# EAGLE design ADS7128 (EAGLE 9.6.2)
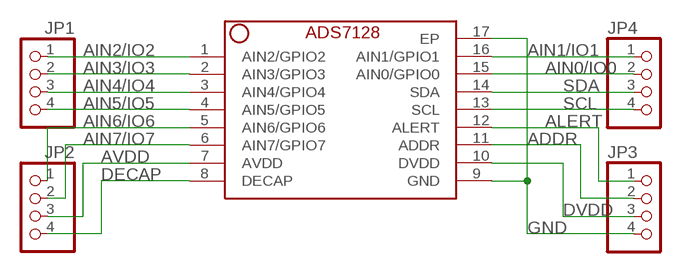
[diagram p0: schematic, sheet 1]

## Parts
JP1  PINHD-1X4  [1X04]
JP2  PINHD-1X4  [1X04]
JP3  PINHD-1X4  [1X04]
JP4  PINHD-1X4  [1X04]
U$1  ADS7128  [QFN50P300X300X80-17N]

## Nets
ADDR: JP3.2 U$1.11(ADDR)
AIN0/IO0: JP4.2 U$1.15(AIN0/GPIO0)
AIN1/IO1: JP4.1 U$1.16(AIN1/GPIO1)
AIN2/IO2: JP1.1 U$1.1(AIN2/GPIO2)
AIN3/IO3: JP1.2 U$1.2(AIN3/GPIO3)
AIN4/IO4: JP1.3 U$1.3(AIN4/GPIO4)
AIN5/IO5: JP1.4 U$1.4(AIN5/GPIO5)
AIN6/IO6: JP2.1 U$1.5(AIN6/GPIO6)
AIN7/IO7: JP2.2 U$1.6(AIN7/GPIO7)
ALERT: JP3.1 U$1.12(ALERT)
AVDD: JP2.3 U$1.7(AVDD)
DECAP: JP2.4 U$1.8(DECAP)
DVDD: JP3.3 U$1.10(DVDD)
GND: JP3.4 U$1.9(GND) U$1.17(EP)
SCL: JP4.4 U$1.13(SCL)
SDA: JP4.3 U$1.14(SDA)

## Library data of the parts
JP1-JP4 = pinhead:PINHD-1X4: PIN HEADER
U$1 = ADS7128:ADS7128

## Board
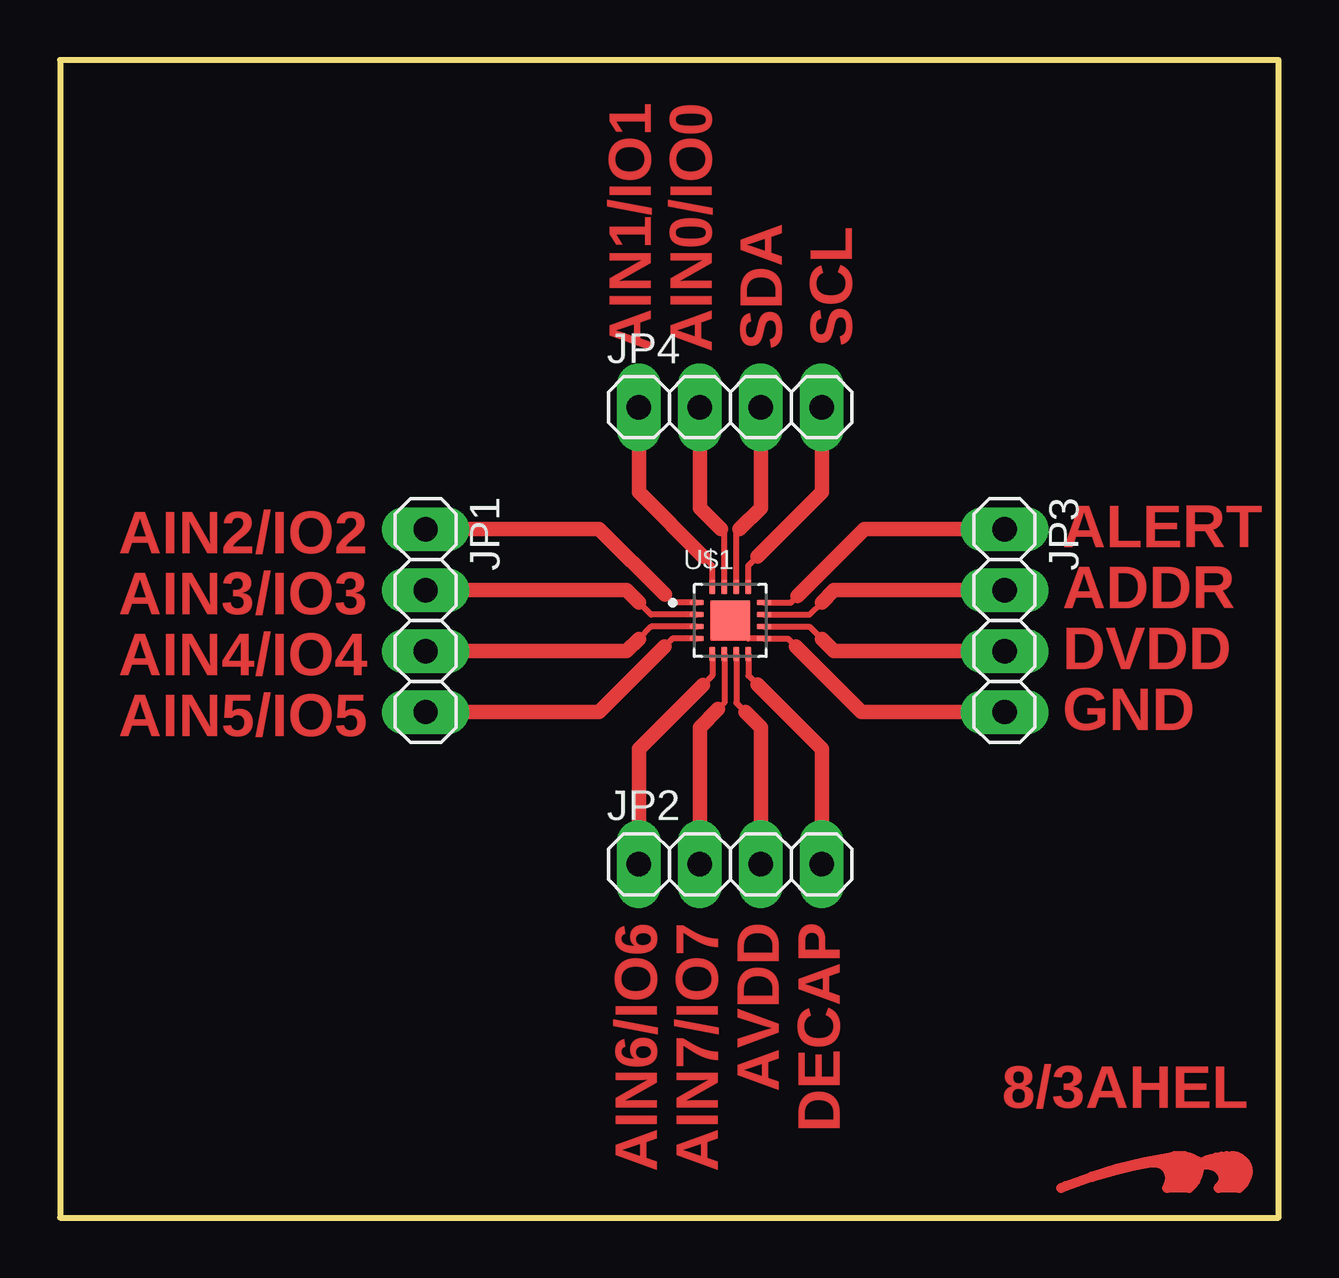
[diagram p1: board, top side]

Size 50.8 x 48.26 mm. Coordinates in mm from the lower left corner, seen from the top.
Outline: 0,0 50.8,0 50.8,48.26 0,48.26 0,0
Copper layers (1*16): Top 0.035mm / dielectric 1.5mm / Bottom 0.035mm
Design rules "default *": minimum track width 6mil, minimum drill 0.35mm, track to track 6mil, track to pad 6mil, pad to pad 6mil, via to via 6mil, smd to smd 6mil, copper to edge 40mil, drill to drill 6mil, minimum pad ring 16mil, minimum via ring 8mil, stop-mask expansion 4mil, vias tented up to drill 0mil, thermal gap 10mil

### Footprints (pad centres in the part's own frame; a part is rotated, then mirrored left to right if it is on the bottom)
1X04 = drill 1.016 long: 1 -3.81,0; 2 -1.27,0; 3 1.27,0; 4 3.81,0
QFN50P300X300X80-17N = smd 0.6 x 0.24: 1 -1.4,0.75; 2 -1.4,0.25; 3 -1.4,-0.25; 4 -1.4,-0.75; 9 1.4,-0.75; 10 1.4,-0.25; 11 1.4,0.25; 12 1.4,0.75 | smd 0.24 x 0.6: 5 -0.75,-1.4; 6 -0.25,-1.4; 7 0.25,-1.4; 8 0.75,-1.4; 13 0.75,1.4; 14 0.25,1.4; 15 -0.25,1.4; 16 -0.75,1.4 | smd 1.68 x 1.68: 17 0,0

### Placement (x,y rotation side)
JP1  15.24,24.89 270 top
JP2  27.94,14.73 0 top
JP3  39.37,24.89 270 top
JP4  27.94,33.78 0 top
U$1  27.94,24.89 0 top
U$2  [LOGOTOP_8]  46.99,1.27 0 top

### Tracks (layer width: path | path; a pad name or v marks a point on that pad's centre or on a via)
ADDR
  Top 0.254: U$1.11 31.24,25.14 31.75,25.65
  Top 0.61: JP3.2 32.26,26.16 31.75,25.65
AIN0/IO0
  Top 0.254: U$1.15 27.69,28.57 27.56,28.7
  Top 0.61: JP4.2 26.67,29.59 27.56,28.7
AIN1/IO1
  Top 0.254: U$1.16 27.19,27.18 26.8,27.57 25.67,28.7
  Top 0.61: JP4.1 24.13,30.24 26.8,27.57
AIN2/IO2
  Top 0.254: U$1.1 25.54,25.64 25.21,25.97 24.13,27.05
  Top 0.61: JP1.1 22.48,28.7 25.21,25.97
AIN3/IO3
  Top 0.254: U$1.2 24.64,25.14 24.13,25.65
  Top 0.61: JP1.2 23.62,26.16 24.13,25.65
AIN4/IO4
  Top 0.254: U$1.3 24.64,24.64 24.13,24.13
  Top 0.61: JP1.3 23.62,23.62 24.13,24.13
AIN5/IO5
  Top 0.254: U$1.4 25.52,24.14 25.2,23.82 24.13,22.75
  Top 0.61: JP1.4 22.46,21.08 25.2,23.82
AIN6/IO6
  Top 0.254: U$1.5 27.19,22.6 26.8,22.22 26.68,22.1
  Top 0.61: JP2.1 24.13,19.54 26.8,22.22
AIN7/IO7
  Top 0.254: U$1.6 27.69,21.47 27.43,21.21
  Top 0.61: JP2.2 26.67,20.45 27.43,21.21
ALERT
  Top 0.254: U$1.12 30.47,25.64 30.73,25.91 31.75,26.92
  Top 0.61: JP3.1 33.53,28.7 30.73,25.91
AVDD
  Top 0.254: U$1.7 28.19,21.47 28.57,21.08
  Top 0.61: JP2.3 29.21,20.45 28.57,21.08
DECAP
  Top 0.254: U$1.8 28.69,22.6 29.07,22.23
  Top 0.61: JP2.4 31.75,19.54 29.07,22.23
DVDD
  Top 0.254: U$1.10 31.24,24.64 31.75,24.13
  Top 0.61: JP3.3 32.26,23.62 31.75,24.13
GND
  Top 0.254: U$1.17 28.69,24.14 U$1.9 30.34,24.14 30.67,23.81 31.75,22.73
  Top 0.61: JP3.4 33.4,21.08 30.67,23.81
SCL
  Top 0.254: U$1.13 28.69,27.18 29.08,27.57 30.21,28.7
  Top 0.61: JP4.4 31.75,30.24 29.08,27.57
SDA
  Top 0.254: U$1.14 28.19,28.57 28.32,28.7
  Top 0.61: JP4.3 29.21,29.59 28.32,28.7

### Text on the board
Top: AIN1/IO1 | AIN0/IO0 | SDA | SCL | AIN2/IO2 | ALERT | AIN3/IO3 | ADDR | AIN4/IO4 | DVDD | AIN5/IO5 | GND | AIN6/IO6 | AIN7/IO7 | AVDD | DECAP | 8/3AHEL